// Quartus schematic Projeto_Final.bdf as structural Verilog: 12 symbols, 9 pins
module Projeto_Final (
  input  clk,
  input  pb1,
  inout  ps2_clk,
  inout  ps2_data,
  output R,
  output G,
  output B,
  output H,
  output V
);

  wire inst19_q0, inst19_q1, inst19_q2, inst19_q3, inst19_q4, inst19_q5, inst19_q6, inst19_q7, inst20_q0,
       inst20_q1, inst20_q2, inst20_q3, inst20_q4, inst20_q5, inst20_q6, inst20_q7, inst21_q0, inst21_q1,
       inst21_q2, inst21_q3, inst21_q4, inst21_q5, inst21_q6, inst21_q7, inst22_q0, inst22_q1, inst22_q2,
       inst22_q3, inst22_q4, inst22_q5, inst22_q6, inst22_q7, inst_s, undriven_3;
  wire [7:0] undriven, undriven_2, undriven_4, undriven_5;
  wire [9:0] column, inst7_result, inst8_result, row;
  wire [23:0] mouse_data;

  resgistrador inst20 (
    .clk(clk), .Q0(inst20_q0), .Q1(inst20_q1), .Q2(inst20_q2), .Q3(inst20_q3), .Q4(inst20_q4),
    .Q5(inst20_q5), .Q6(inst20_q6), .Q7(inst20_q7));  // open: D0, D1, D2, D3, D4, D5, D6, D7
  resgistrador inst22 (
    .clk(undriven_3), .Q0(inst22_q0), .Q1(inst22_q1), .Q2(inst22_q2), .Q3(inst22_q3), .Q4(inst22_q4),
    .Q5(inst22_q5), .Q6(inst22_q6), .Q7(inst22_q7));  // open: D0, D1, D2, D3, D4, D5, D6, D7
  lessthan inst9 (.dataa(undriven), .datab(undriven_2));  // open: alb
  lessthan inst23 (.dataa(undriven_5), .datab(undriven_4));  // open: alb
  resgistrador inst19 (
    .Q0(inst19_q0), .Q1(inst19_q1), .Q2(inst19_q2), .Q3(inst19_q3), .Q4(inst19_q4), .Q5(inst19_q5),
    .Q6(inst19_q6), .Q7(inst19_q7));  // open: D0, D1, D2, D3, clk, D4, D5, D6, D7
  resgistrador inst21 (
    .Q0(inst21_q0), .Q1(inst21_q1), .Q2(inst21_q2), .Q3(inst21_q3), .Q4(inst21_q4), .Q5(inst21_q5),
    .Q6(inst21_q6), .Q7(inst21_q7));  // open: D0, D1, D2, D3, clk, D4, D5, D6, D7
  lpm_add_sub0 inst7 (.dataa(row), .datab(mouse_data[15:8]), .result(inst7_result));
  lpm_add_sub0 inst8 (.dataa(column), .datab(mouse_data[7:0]), .result(inst8_result));
  ps2_mouse #(.clk_freq(25175000), .ps2_debounce_counter_size(7)) inst1 (
    .clk(clk), .reset_n(pb1), .mouse_data(mouse_data), .ps2_clk(ps2_clk), .ps2_data(ps2_data));  // open: mouse_data_new
  mira inst (
    .clk(clk), .updown(mouse_data[21]), .row(inst7_result), .column(inst8_result),
    .rightleft(mouse_data[20]), .s(inst_s));  // open: nrst, cnt_en
  JKFF inst3 (.PRN(1'b1), .CLRN(1'b1));  // open: K, J, CLK, Q
  VGAdrive inst2 (
    .clock(clk), .red(inst_s), .row(row), .column(column), .Rout(R), .Gout(G), .Bout(B), .H(H), .V(V));  // open: green, blue
endmodule
